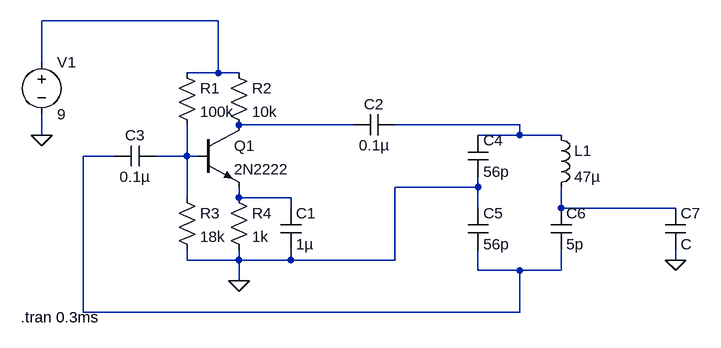
[diagram p0: schematic OSC CLAPP.asc]
OSC CLAPP.asc, the LTspice schematic file:
Version 4
SHEET 1 904 680
WIRE 160 -32 -112 -32
WIRE -112 32 -112 -32
WIRE 160 48 160 -32
WIRE 160 48 112 48
WIRE 192 48 160 48
WIRE 368 128 192 128
WIRE 624 128 432 128
WIRE -112 144 -112 112
WIRE 624 144 624 128
WIRE 624 144 560 144
WIRE 688 144 624 144
WIRE 0 176 -48 176
WIRE 112 176 112 128
WIRE 112 176 64 176
WIRE 128 176 112 176
WIRE 560 224 560 208
WIRE 560 224 432 224
WIRE 112 240 112 176
WIRE 192 240 192 224
WIRE 272 240 192 240
WIRE 272 256 272 240
WIRE 560 256 560 224
WIRE 688 256 688 224
WIRE 864 256 688 256
WIRE 112 336 112 320
WIRE 192 336 192 320
WIRE 192 336 112 336
WIRE 272 336 272 320
WIRE 272 336 192 336
WIRE 432 336 432 224
WIRE 432 336 272 336
WIRE 864 336 864 320
WIRE 560 352 560 320
WIRE 624 352 560 352
WIRE 688 352 688 320
WIRE 688 352 624 352
WIRE 192 368 192 336
WIRE -48 416 -48 176
WIRE 624 416 624 352
WIRE 624 416 -48 416
FLAG -112 144 0
FLAG 192 368 0
FLAG 864 336 0
SYMBOL voltage -112 16 R0
WINDOW 123 0 0 Left 0
WINDOW 39 0 0 Left 0
SYMATTR InstName V1
SYMATTR Value 9
SYMBOL npn 128 128 R0
SYMATTR InstName Q1
SYMATTR Value 2N2222
SYMBOL res 96 32 R0
SYMATTR InstName R1
SYMATTR Value 100k
SYMBOL res 176 32 R0
SYMATTR InstName R2
SYMATTR Value 10k
SYMBOL res 96 224 R0
SYMATTR InstName R3
SYMATTR Value 18k
SYMBOL res 176 224 R0
SYMATTR InstName R4
SYMATTR Value 1k
SYMBOL cap 256 256 R0
SYMATTR InstName C1
SYMATTR Value 1µ
SYMBOL cap 432 112 R90
WINDOW 0 0 32 VBottom 2
WINDOW 3 32 32 VTop 2
SYMATTR InstName C2
SYMATTR Value 0.1µ
SYMBOL cap 64 160 R90
WINDOW 0 0 32 VBottom 2
WINDOW 3 32 32 VTop 2
SYMATTR InstName C3
SYMATTR Value 0.1µ
SYMBOL cap 544 144 R0
SYMATTR InstName C4
SYMATTR Value 56p
SYMBOL cap 544 256 R0
SYMATTR InstName C5
SYMATTR Value 56p
SYMBOL cap 672 256 R0
SYMATTR InstName C6
SYMATTR Value 5p
SYMBOL ind 672 128 R0
SYMATTR InstName L1
SYMATTR Value 47µ
SYMBOL cap 848 256 R0
SYMATTR InstName C7
TEXT -144 424 Left 2 !.tran 0.3ms

The netlist it stands for:
* OSC CLAPP.asc
V1 N001 0 9
Q1 N002 N005 N006 0 2N2222
R1 N001 N005 100k
R2 N001 N002 10k
R3 N005 0 18k
R4 N006 0 1k
C1 N006 0 1µ
C2 N003 N002 0.1µ
C3 N005 N004 0.1µ
C4 N003 0 56p
C5 0 N004 56p
C6 N007 N004 5p
L1 N003 N007 47µ
C7 N007 0 C
.model NPN NPN
.model PNP PNP
.lib standard.bjt
.tran 0.3ms
.backanno
.end